# EAGLE design rx_mod-1 (EAGLE 7.2.0)
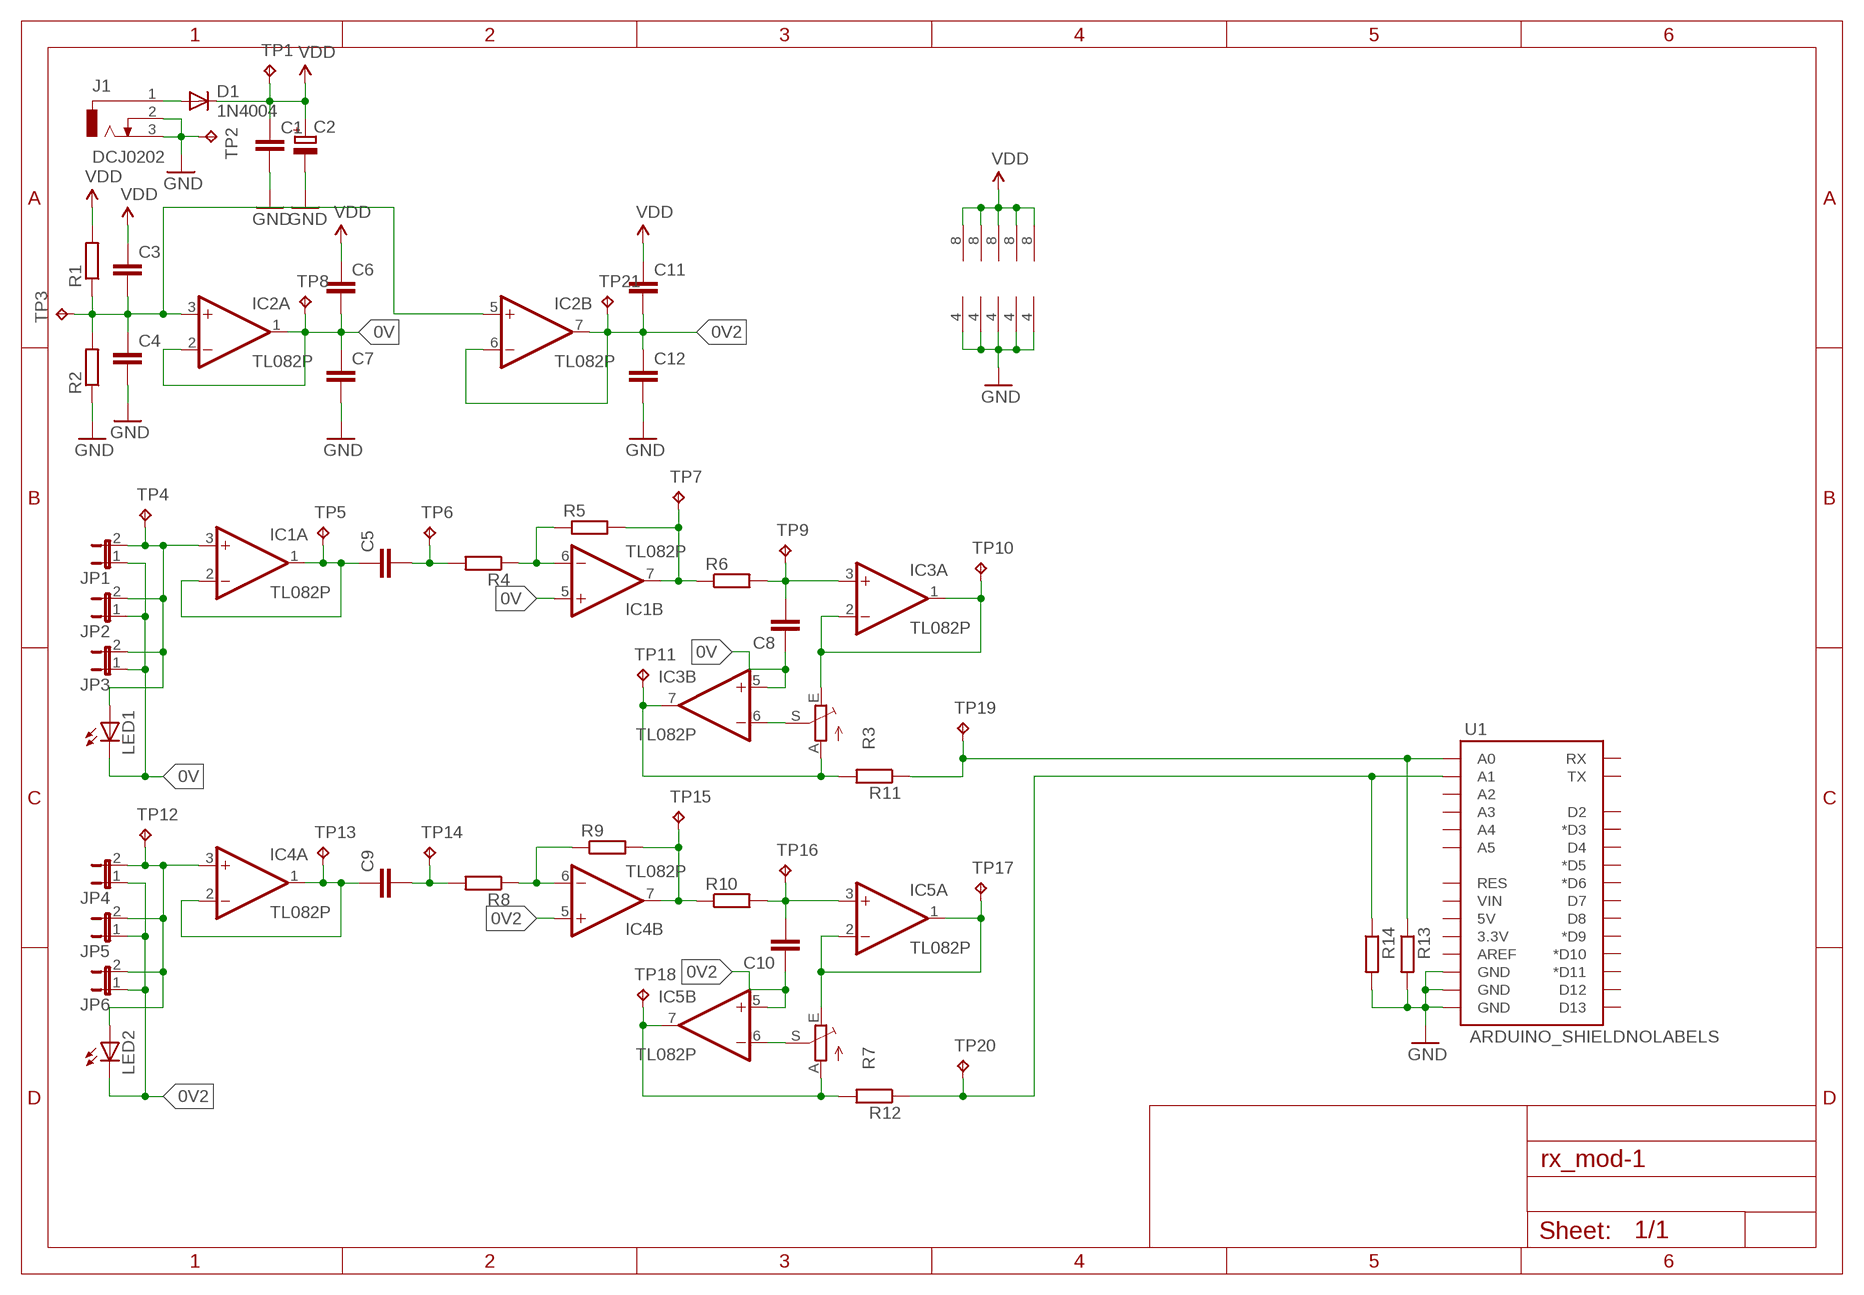
[diagram p0: schematic, sheet 1]

## Parts
C1  C-EU050-030X075  [C050-030X075]
C2  CPOL-EUE2.5-6  [E2,5-6]
C3  C-EU050-030X075  [C050-030X075]
C4  C-EU050-030X075  [C050-030X075]
C5  C-EU050-030X075  [C050-030X075]
C6  C-EU050-030X075  [C050-030X075]
C7  C-EU050-030X075  [C050-030X075]
C8  C-EU050-030X075  [C050-030X075]
C9  C-EU050-030X075  [C050-030X075]
C10  C-EU050-030X075  [C050-030X075]
C11  C-EU050-030X075  [C050-030X075]
C12  C-EU050-030X075  [C050-030X075]
D1  1N4004  [DO41-10]
IC1  TL082P  [DIL08]
IC2  TL082P  [DIL08]
IC3  TL082P  [DIL08]
IC4  TL082P  [DIL08]
IC5  TL082P  [DIL08]
J1  DCJ0202  [DCJ0202]
JP1  JP1E  [JP1]
JP2  JP1E  [JP1]
JP3  JP1E  [JP1]
JP4  JP1E  [JP1]
JP5  JP1E  [JP1]
JP6  JP1E  [JP1]
LED1  LED5MM  [LED5MM]
LED2  LED5MM  [LED5MM]
R1  R-EU_0207/10  [0207/10]
R2  R-EU_0207/10  [0207/10]
R3  TRIM_EU-CA9V  [CA9V]
R4  R-EU_0207/10  [0207/10]
R5  R-EU_0207/2V  [0207/2V]
R6  R-EU_0207/2V  [0207/2V]
R7  TRIM_EU-CA9V  [CA9V]
R8  R-EU_0207/10  [0207/10]
R9  R-EU_0207/2V  [0207/2V]
R10  R-EU_0207/2V  [0207/2V]
R11  R-EU_0207/10  [0207/10]
R12  R-EU_0207/10  [0207/10]
R13  R-EU_0207/10  [0207/10]
R14  R-EU_0207/10  [0207/10]
TP1  TPPAD1-13  [P1-13]
TP2  TPPAD1-13  [P1-13]
TP3  TPPAD1-13  [P1-13]
TP4  TPPAD1-13  [P1-13]
TP5  TPPAD1-13  [P1-13]
TP6  TPPAD1-13  [P1-13]
TP7  TPPAD1-13  [P1-13]
TP8  TPPAD1-13  [P1-13]
TP9  TPPAD1-13  [P1-13]
TP10  TPPAD1-13  [P1-13]
TP11  TPPAD1-13  [P1-13]
TP12  TPPAD1-13  [P1-13]
TP13  TPPAD1-13  [P1-13]
TP14  TPPAD1-13  [P1-13]
TP15  TPPAD1-13  [P1-13]
TP16  TPPAD1-13  [P1-13]
TP17  TPPAD1-13  [P1-13]
TP18  TPPAD1-13  [P1-13]
TP19  TPPAD1-13  [P1-13]
TP20  TPPAD1-13  [P1-13]
TP21  TPPAD1-13  [P1-13]
U1  ARDUINO_SHIELDNOLABELS  [DUEMILANOVE_SHIELD_NOLABELS]

## Nets
0V: C6.2 C7.1 C8.1 IC1.5(B:+IN) IC2.1(A:OUT) IC2.2(A:-IN) IC3.5(B:+IN) JP1.1 JP2.1 JP3.1 LED1.K(C) TP8.TP
0V2: C10.1 C11.2 C12.1 IC2.6(B:-IN) IC2.7(B:OUT) IC4.5(B:+IN) IC5.5(B:+IN) JP4.1 JP5.1 JP6.1 LED2.K(C) TP21.TP
GND: C1.2 C2.- C4.2 C7.2 C12.2 IC1.4(P:V-) IC2.4(P:V-) IC3.4(P:V-) IC4.4(P:V-) IC5.4(P:V-) J1.2 J1.3 R2.1 R13.2 R14.2 TP2.TP U1.GND@0(GND) U1.GND@1(GND) U1.GND@2(GND)
N$1: D1.A J1.1
N$2: C5.1 IC1.1(A:OUT) IC1.2(A:-IN) TP5.TP
N$3: IC1.3(A:+IN) JP1.2 JP2.2 JP3.2 LED1.A TP4.TP
N$4: C5.2 R4.2 TP6.TP
N$5: IC1.6(B:-IN) R4.1 R5.1
N$6: IC1.7(B:OUT) R5.2 R6.1 TP7.TP
N$7: C8.2 IC3.3(A:+IN) R6.2 TP9.TP
N$8: C3.2 C4.1 IC2.3(A:+IN) IC2.5(B:+IN) R1.1 R2.2 TP3.TP
N$9: IC3.1(A:OUT) IC3.2(A:-IN) R3.E TP10.TP
N$10: IC4.3(A:+IN) JP4.2 JP5.2 JP6.2 LED2.A TP12.TP
N$11: IC3.6(B:-IN) R3.S
N$12: IC3.7(B:OUT) R3.A R11.2 TP11.TP
N$13: C9.1 IC4.1(A:OUT) IC4.2(A:-IN) TP13.TP
N$14: C9.2 R8.2 TP14.TP
N$15: IC4.6(B:-IN) R8.1 R9.1
N$16: IC4.7(B:OUT) R9.2 R10.1 TP15.TP
N$17: C10.2 IC5.3(A:+IN) R10.2 TP16.TP
N$18: IC5.1(A:OUT) IC5.2(A:-IN) R7.E TP17.TP
N$19: IC5.6(B:-IN) R7.S
N$20: IC5.7(B:OUT) R7.A R12.2 TP18.TP
N$23: R11.1 R13.1 TP19.TP U1.A0
N$24: R12.1 R14.1 TP20.TP U1.A1
VDD: C1.1 C2.+ C3.1 C6.1 C11.1 D1.C IC1.8(P:V+) IC2.8(P:V+) IC3.8(P:V+) IC4.8(P:V+) IC5.8(P:V+) R1.2 TP1.TP
Unconnected: U1.3.3V U1.5V U1.A2 U1.A3 U1.A4 U1.A5 U1.AREF U1.D2 U1.D3(*D3) U1.D4 U1.D5(*D5) U1.D6(*D6) U1.D7 U1.D8 U1.D9(*D9) U1.D10(*D10) U1.D11(*D11) U1.D12 U1.D13 U1.RES U1.RX U1.TX U1.VIN

## Library data of the parts
C1 C3-C12 = resistor:C-EU: CAPACITOR, European symbol
C2 = resistor:CPOL-EU: POLARIZED CAPACITOR, European symbol
D1 = diode:1N4004: DIODE general purpose rectifier, 1 A
IC1-IC5 = linear:TL082: OP AMP Data sheet <http://www.ti.com/lit/ds/symlink/tl084a . pdf>; DATA_SHEET: <a href="http://www.ti.com/lit/ds/symlink/tl084a.pdf"> Data sheet </a>
J1 = con-jack:DCJ0202: DC POWER JACK Source: DCJ0202.pdf; OC_FARNELL: unknown; OC_NEWARK: unknown
JP1-JP6 = jumper:JP1E: JUMPER
LED1 LED2 = led:LED: LED OSRAM: - CHIPLED LG R971, LG N971, LY N971, LG Q971, LY Q971, LO R971, LY R971 LH N974, LH R974 LS Q976, LO Q976, LY Q976 LO Q996 - Hyper CHIPLED LW Q18S LB Q993, LB Q99A, LB R99A - SideLED LS A670, LO A670, LY A670, LG A670, LP A670 LB A673, LV A673, LT A673, LW A673 LH A674 LY A675 LS A676, LA A676, LO A676, LY A676, LW A676 LS A679, LY A679, LG A679 - Hyper Micro SIDELED® LS Y876, LA Y876, LO Y876, LY Y876 LT Y87S - SmartLED LW L88C, LW L88S LB L89C, LB L89S, LG L890 LS L89K, LO L89K, LY L89K LS L896, LA L896, LO L896, LY L896 - TOPLED LS T670, LO T670, LY T670, LG T670, LP T670 LSG T670, LSP T670, LSY T670, LOP T670, LYG T670 LG T671, LOG T671, LSG T671 LB T673, LV T673, LT T673, LW T673 LH T674 LS T676, LA T676, LO T676, LY T676, LB T676, LH T676, LSB T676, LW T676 LB T67C, LV T67C, LT T67C, LS T67K, LO T67K, LY T67K, LW E67C LS E67B, LA E67B, LO E67B, LY E67B, LB E67C, LV E67C, LT E67C LW T67C LS T679, LY T679, LG T679 LS T770, LO T770, LY T770, LG T770, LP T770 LB T773, LV T773, LT T773, LW T773 LH T774 LS E675, LA E675, LY E675, LS T675 LS T776, LA T776, LO T776, LY T776, LB T776 LHGB T686 LT T68C, LB T68C - Hyper Mini TOPLED® LB M676 - Mini TOPLED Santana® LG M470 LS M47K, LO M47K, LY M47K Source: http://www.osram.convergy.de LUXEON: - LUMILED® LXK2-PW12-R00, LXK2-PW12-S00, LXK2-PW14-U00, LXK2-PW14-V00 LXK2-PM12-R00, LXK2-PM12-S00, LXK2-PM14-U00 LXK2-PE12-Q00, LXK2-PE12-R00, LXK2-PE12-S00, LXK2-PE14-T00, LXK2-PE14-U00 LXK2-PB12-K00, LXK2-PB12-L00, LXK2-PB12-M00, LXK2-PB14-N00, LXK2-PB14-P00, LXK2-PB14-Q00 LXK2-PR12-L00, LXK2-PR12-M00, LXK2-PR14-Q00, LXK2-PR14-R00 LXK2-PD12-Q00, LXK2-PD12-R00, LXK2-PD12-S00 LXK2-PH12-R00, LXK2-PH12-S00 LXK2-PL12-P00, LXK2-PL12-Q00, LXK2-PL12-R00 Source: www.luxeon.com KINGBRIGHT: KA-3528ASYC Source: www.kingbright.com
R1 R2 R4-R6 R8-R14 = resistor:R-EU_: RESISTOR, European symbol
R3 R7 = pot:TRIM_EU-: POTENTIOMETER
TP1-TP21 = testpad:TP: Test pad
U1 = SparkFun-Boards:ARDUINO_SHIELD: Arduino shield footprint

## Board
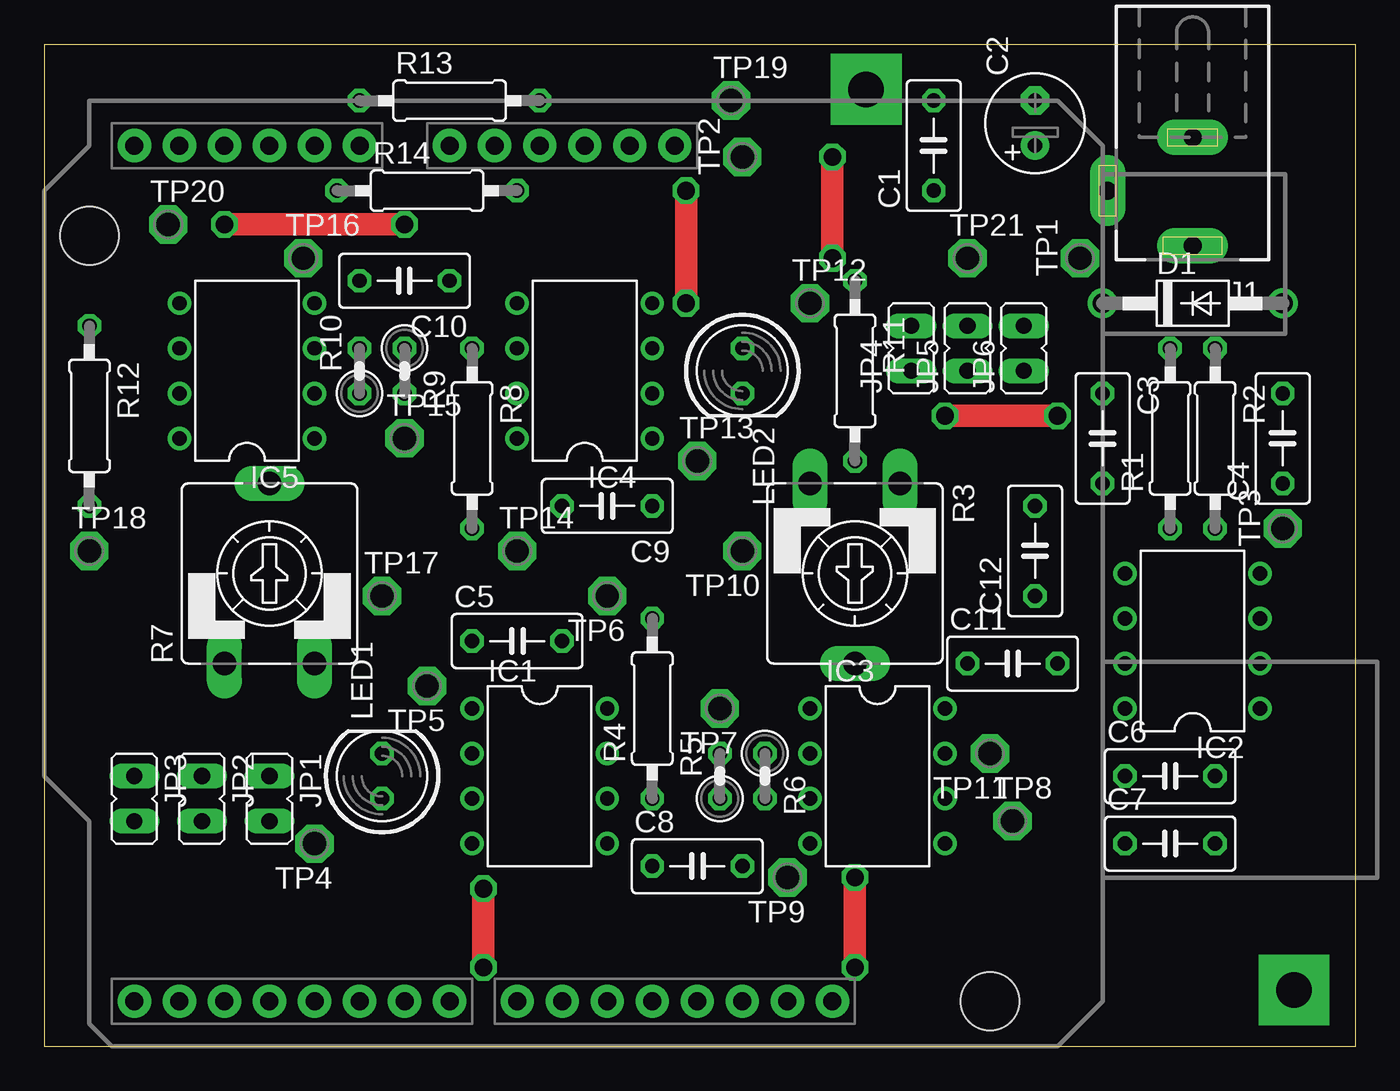
[diagram p1: board, top side]
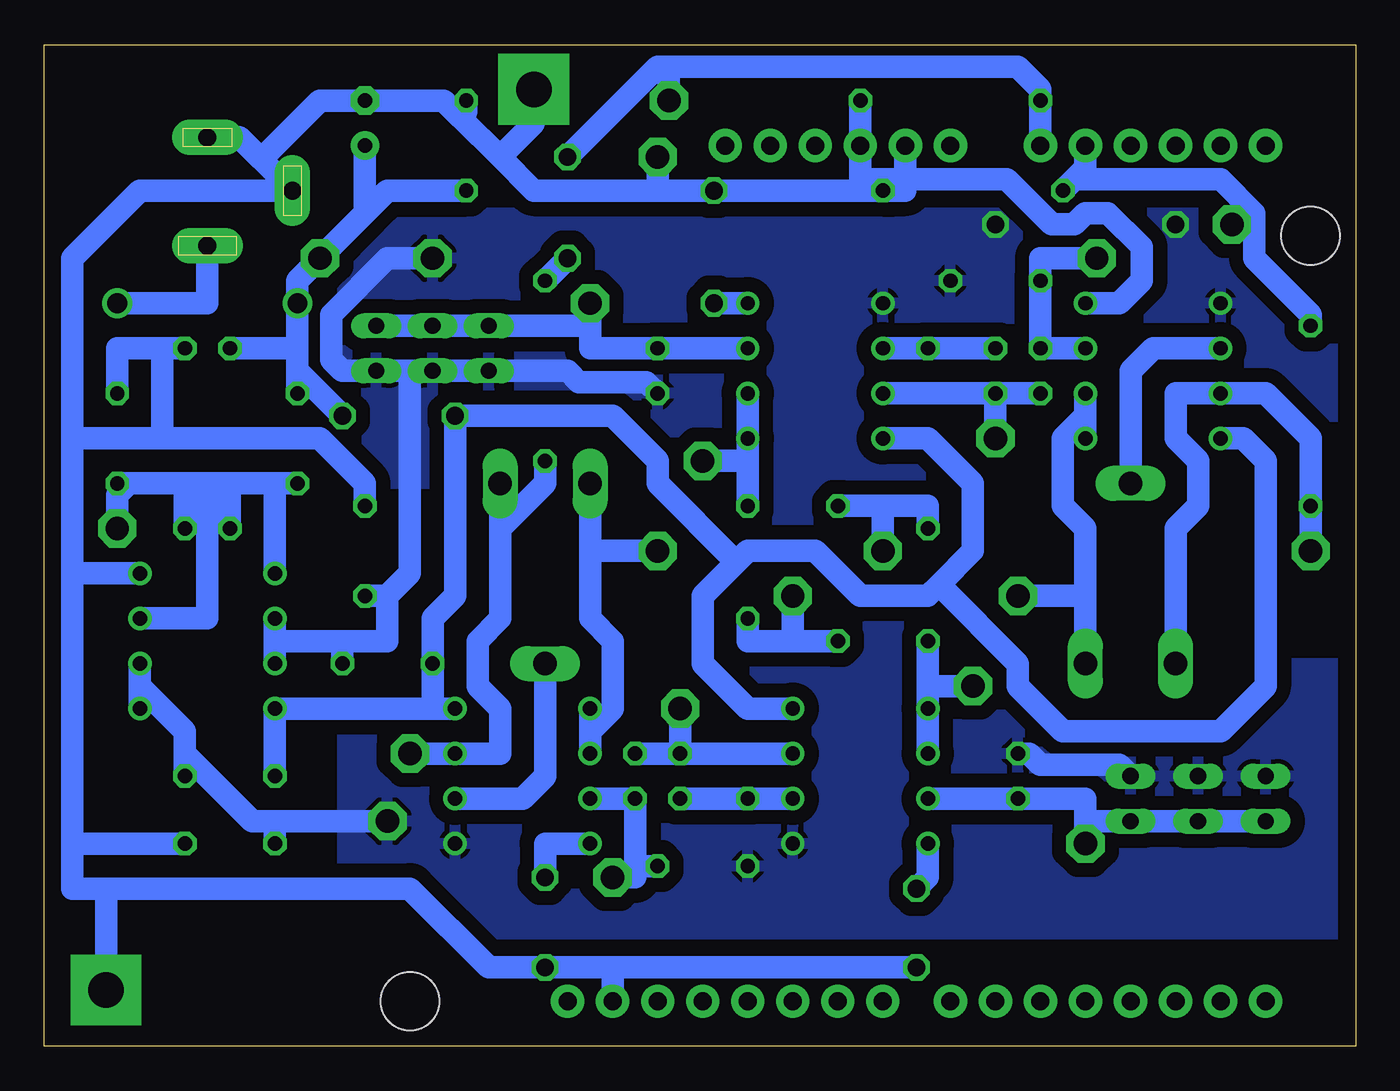
[diagram p2: board, bottom side, seen from below]

Size 73.97 x 56.51 mm. Coordinates in mm from the lower left corner, seen from the top.
Outline: 0,0 73.97,0 73.97,56.51 0,56.51 0,0
Copper layers (1*16): Top 0.035mm / dielectric 1.5mm / Bottom 0.035mm
Design rules "default": minimum track width 10mil, minimum drill 24mil, track to track 8mil, track to pad 8mil, pad to pad 8mil, via to via 8mil, smd to smd 8mil, copper to edge 40mil, drill to drill 8mil, minimum pad ring 10mil, minimum via ring 8mil, stop-mask expansion 4mil, vias tented up to drill 0mil, thermal gap 10mil

### Footprints (pad centres in the part's own frame; a part is rotated, then mirrored left to right if it is on the bottom)
C050-030X075 = drill 0.813 octagon: 1 -2.54,0; 2 2.54,0
E2,5-6 = drill 0.813 pad 1.6: + -1.27,0 | drill 0.813 pad 1.6 octagon: - 1.27,0
DO41-10 = drill 1.118: A 5.08,0; C -5.08,0
DIL08 = drill 0.813 pad 1.27: 1 -3.81,-3.81; 2 -1.27,-3.81; 3 1.27,-3.81; 4 3.81,-3.81; 5 3.81,3.81; 6 1.27,3.81; 7 -1.27,3.81; 8 -3.81,3.81
DCJ0202 = drill 1 pad 2 long: 1 0,3.1; 2 4.8,0; 3 0,-3
JP1 = drill 0.914 long: 1 0,-1.27; 2 0,1.27
LED5MM = drill 0.813 octagon: A -1.27,0; K 1.27,0
0207/10 = drill 0.813 octagon: 1 -5.08,0; 2 5.08,0
CA9V = drill 1.321 long: A -2.54,-5.08; E 2.54,-5.08; S 0,5.08
0207/2V = drill 0.813 octagon: 1 -1.27,0; 2 1.27,0
P1-13 = drill 1.321 pad 2.159 octagon: TP 0,0
DUEMILANOVE_SHIELD_NOLABELS = drill 1.016 pad 1.88: 3.3V 50.8,26.67; 5V 50.8,29.21; A0 50.8,41.91; A1 50.8,44.45; A2 50.8,46.99; A3 50.8,49.53; A4 50.8,52.07; A5 50.8,54.61; AREF 2.54,15.24; D2 2.54,49.53; D3 2.54,46.99; D4 2.54,44.45; D5 2.54,41.91; D6 2.54,39.37; D7 2.54,36.83; D8 2.54,33.02; D9 2.54,30.48; D10 2.54,27.94; D11 2.54,25.4; D12 2.54,22.86; D13 2.54,20.32; GND@0 50.8,31.75; GND@1 50.8,34.29; GND@2 2.54,17.78; RES 50.8,24.13; RX 2.54,54.61; TX 2.54,52.07; VIN 50.8,36.83 | hole 3.302: 45.72,57.15; 2.54,6.35

### Placement (x,y rotation side)
C1  50.16,50.8 90 top
C2  55.88,52.07 90 top
C3  59.69,34.29 270 top
C4  69.85,34.29 90 top
C5  26.67,22.86 0 top
C6  63.5,15.24 0 top
C7  63.5,11.43 0 top
C8  36.83,10.16 0 top
C9  31.75,30.48 180 top
C10  20.32,43.18 180 top
C11  54.61,21.59 0 top
C12  55.88,27.94 90 top
D1  64.77,41.91 0 top
IC1  27.94,15.24 270 top
IC2  64.77,22.86 90 top
IC3  46.99,15.24 270 top
IC4  30.48,38.1 90 top
IC5  11.43,38.1 90 top
J1  64.77,48.26 180 top
JP1  12.7,13.97 180 top
JP2  8.89,13.97 180 top
JP3  5.08,13.97 180 top
JP4  48.9,39.37 0 top
JP5  52.07,39.37 0 top
JP6  55.24,39.37 0 top
LED1  19.05,15.24 90 top
LED2  39.37,38.1 270 top
R1  63.5,34.29 90 top
R2  66.04,34.29 270 top
R3  45.72,26.67 180 top
R4  34.29,19.05 90 top
R5  38.1,15.24 90 top
R6  40.64,15.24 270 top
R7  12.7,26.67 0 top
R8  24.13,34.29 270 top
R9  20.32,38.1 270 top
R10  17.78,38.1 90 top
R11  45.72,38.1 270 top
R12  2.54,35.56 270 top
R13  22.86,53.34 0 top
R14  21.59,48.26 0 top
TP1  58.42,44.45 90 top
TP2  39.37,50.16 90 top
TP3  69.85,29.21 90 top
TP4  15.24,11.43 180 top
TP5  21.59,20.32 180 top
TP6  31.75,25.4 180 top
TP7  38.1,19.05 180 top
TP8  54.61,12.7 0 top
TP9  41.91,9.53 180 top
TP10  39.37,27.94 180 top
TP11  53.34,16.51 180 top
TP12  43.18,41.91 0 top
TP13  36.83,33.02 0 top
TP14  26.67,27.94 0 top
TP15  20.32,34.29 0 top
TP16  14.61,44.45 0 top
TP17  19.05,25.4 0 top
TP18  2.54,27.94 0 top
TP19  38.73,53.34 0 top
TP20  6.99,46.35 0 top
TP21  52.07,44.45 0 top
U1  59.69,0 90 top

### Tracks (layer width: path | path; a pad name or v marks a point on that pad's centre or on a via)
0V
  Bottom 1.27: LED1.K 18.41,16.51 17.78,15.88 13.34,15.88 JP1.1 | IC2.1 68.58,20.32 | 68.58,20.32 IC2.2 | 66.04,16.51 66.04,17.78 68.58,20.32 | C6.2 66.04,16.51 | 66.04,16.51 62.23,12.7 60.96,12.7 | 60.96,12.7 TP8.TP | C7.1 60.96,12.7
  pour Bottom (isolate 0.8): 57.15,6.35 0,6.35 0,21.59 19.05,21.59 22.86,25.4 29.21,25.4 30.48,26.67 35.56,26.67 39.37,30.48 57.15,30.48
0V2  (via drill 1)
  Top 1.27: v10.16,46.35 v20.32,46.35
  Bottom 1.27: IC2.6 60.96,22.86 | 60.96,22.86 IC2.7 | C11.2 57.15,22.86 | 57.15,22.86 60.96,22.86 | 57.15,22.86 54.61,22.86 54.61,25.4 | 54.61,25.4 53.34,26.67 53.34,38.1 | C12.1 54.61,25.4 | LED2.K 40.01,37.47 43.81,37.47 44.45,38.1 JP4.1 JP5.1 53.34,38.1 | 53.34,38.1 JP6.1 57.15,38.1 57.78,38.73 57.78,41.27 54.61,44.45 TP21.TP
  pour Bottom (isolate 0.8): 57.15,31.75 39.37,31.75 35.56,27.94 29.21,27.94 27.94,26.67 22.86,26.67 19.05,22.86 0,22.86 0,46.99 57.15,46.99
GND  (via drill 1, 2 pad 4)
  Top 1.27: v45.72,9.53 v45.72,4.45 | v24.77,8.89 v24.77,4.45 | v36.2,41.91 v36.2,48.26
  Bottom 1.27: R2.1 67.31,39.37 | 67.31,39.37 69.85,39.37 C4.2 | C12.2 55.88,31.75 58.42,34.29 67.31,34.29 | 72.39,26.67 IC2.4 | 72.39,34.29 67.31,34.29 | 67.31,34.29 67.31,39.37 | 72.39,26.67 72.39,11.43 | 41.91,4.45 v45.72,4.45 48.9,4.45 53.34,8.89 70.48,8.89 | 41.91,4.45 U1.GND@2 | C7.2 72.39,11.43 | J1.3 62.97,51.26 61.73,50.02 | 61.73,50.02 J1.2 68.58,48.26 72.39,44.45 72.39,34.29 | 27.94,48.9 U1.GND@0 R13.2 | 27.94,48.9 27.94,48.26 | 27.94,48.26 v36.2,48.26 39.37,48.26 | R14.2 27.94,48.26 | v24.77,4.45 41.91,4.45 | IC3.4 45.72,11.43 v45.72,9.53 | IC1.4 24.13,9.53 v24.77,8.89 | 72.39,11.43 72.39,8.89 70.48,8.89 | U1.GND@1 25.4,48.9 | 25.4,48.9 25.4,48.26 R14.2 | IC4.4 v36.2,41.91 | 39.37,48.26 46.35,48.26 48.26,50.16 | 48.26,50.16 50.48,52.39 | 50.48,52.39 51.44,53.34 C2.- 58.42,53.34 61.73,50.02 | C1.2 50.16,52.7 50.48,52.39 | IC5.4 13.34,41.91 12.06,43.18 12.06,45.09 13.97,46.99 15.24,46.99 15.88,46.35 17.14,46.35 19.68,48.9 25.4,48.9 | R14.2 26.04,48.26 25.4,48.9 | 25.4,48.9 27.94,48.9 | v46.35,53.98 46.35,52.07 48.26,50.16 | TP2.TP 39.37,48.26 | 72.39,34.29 72.39,26.67 | v70.48,3.17 70.48,8.89
N$1
  Bottom 1.27: J1.1 64.77,41.91 D1.A
N$2
  Bottom 1.27: IC1.2 IC1.1 24.13,20.32 | 24.13,20.32 C5.1 | TP5.TP 24.13,20.32
N$3
  Bottom 1.27: IC1.3 LED1.A 15.24,13.97 15.24,12.7 | 15.24,12.7 JP1.2 JP2.2 JP3.2 | TP4.TP 15.24,12.7
N$4
  Bottom 1.27: C5.2 31.75,22.86 | 31.75,22.86 34.29,22.86 R4.2 | TP6.TP 31.75,22.86
N$5
  Bottom 1.27: IC1.6 R4.1 R5.1
N$6
  Bottom 1.27: IC1.7 R5.2 | R6.1 R5.2 | TP7.TP R5.2
N$7
  Bottom 1.27: IC3.3 R6.2 40.64,10.16 | 40.64,10.16 40.64,9.53 TP9.TP | C8.2 40.64,10.16
N$8
  Bottom 1.27: C3.2 60.96,31.75 | 60.96,31.75 63.5,31.75 | 63.5,31.75 64.77,31.75 | 64.77,31.75 66.04,31.75 | 66.04,31.75 69.22,31.75 | 69.22,31.75 C4.1 | R1.1 63.5,31.75 | R2.2 66.04,31.75 | IC2.5 60.96,31.75 | IC2.3 64.77,24.13 64.77,31.75 | TP3.TP 69.85,31.11 69.22,31.75
N$9
  Bottom 1.27: IC3.1 43.18,17.78 | 43.18,17.78 IC3.2 | R3.E 43.18,27.94 | 43.18,27.94 43.18,24.13 41.91,22.86 41.91,19.05 43.18,17.78 | TP10.TP 43.18,27.94
N$10
  Bottom 1.27: JP6.2 JP5.2 JP4.2 43.18,40.64 | 43.18,40.64 43.18,39.37 LED2.A IC4.3 | TP12.TP 43.18,40.64
N$11
  Bottom 1.27: R3.S 45.72,15.24 46.99,13.97 IC3.6
N$12
  Bottom 1.27: R3.A 48.26,29.21 | 48.26,29.21 48.26,24.13 49.53,22.86 49.53,20.32 48.26,19.05 48.26,16.51 IC3.7 TP11.TP | R11.2 45.72,31.75 48.26,29.21
N$13
  Bottom 1.27: IC4.2 IC4.1 34.29,33.02 | 34.29,33.02 C9.1 | TP13.TP 34.29,33.02
N$14
  Bottom 1.27: C9.2 26.67,30.48 | 26.67,30.48 24.13,30.48 R8.2 | TP14.TP 26.67,30.48
N$15
  Bottom 1.27: IC4.6 R8.1 R9.1
N$16
  Bottom 1.27: IC4.7 R9.2 | R10.1 R9.2 | TP15.TP R9.2
N$17
  Bottom 1.27: IC5.3 R10.2 C10.2 17.78,44.45 TP16.TP
N$18
  Bottom 1.27: 15.24,35.56 IC5.1 | IC5.2 15.24,35.56 | 15.24,35.56 16.51,34.29 16.51,30.48 15.24,29.21 15.24,25.4 | 15.24,25.4 R7.E | TP17.TP 15.24,25.4
N$19
  Bottom 1.27: R7.S 12.7,38.1 11.43,39.37 IC5.6
N$20
  Bottom 1.27: R7.A 10.16,29.21 8.89,30.48 8.89,33.02 10.16,34.29 10.16,36.83 IC5.7 5.08,36.83 2.54,34.29 R12.2 TP18.TP
N$23  (via drill 1)
  Top 1.27: v44.45,44.45 v44.45,50.16
  Bottom 1.27: U1.A0 R13.1 17.78,53.98 19.05,55.24 38.73,55.24 | R11.1 v44.45,44.45 | v44.45,50.16 39.37,55.24 38.73,55.24 | TP19.TP 38.73,55.24
N$24
  Bottom 1.27: 15.88,48.9 7.62,48.9 5.71,46.99 | 15.88,48.9 15.24,49.53 U1.A1 | 5.71,46.99 5.71,44.45 2.54,41.27 R12.1 | 15.88,48.9 R14.1 | TP20.TP 6.35,46.35 5.71,46.99
VDD  (via drill 1)
  Top 1.27: v57.15,35.56 v50.8,35.56
  Bottom 1.27: 59.69,39.37 D1.C 59.69,43.18 TP1.TP 55.88,46.99 | C3.1 59.69,38.1 | 59.69,38.1 59.69,39.37 | 59.69,39.37 R1.2 | IC4.8 24.13,34.29 21.59,31.75 21.59,27.94 23.5,26.04 | 34.92,27.3 34.29,27.94 30.48,27.94 27.94,25.4 24.13,25.4 23.5,26.04 | 34.92,27.3 36.83,25.4 36.83,21.59 34.29,19.05 IC1.8 | IC5.8 6.35,34.29 5.08,33.02 5.08,20.32 7.62,17.78 16.51,17.78 19.05,20.32 19.05,21.59 23.5,26.04 | 34.92,27.3 39.37,31.75 39.37,33.02 41.91,35.56 v50.8,35.56 50.8,25.4 52.07,24.13 C11.1 52.07,19.05 | 52.07,19.05 IC2.8 C6.1 | v57.15,35.56 59.69,38.1 | IC3.8 52.07,19.05 | 55.88,46.99 54.61,48.26 C1.1 | C2.+ 55.88,46.99